# Altium schematic sheet daq_testing.SchDoc
size A; SheetNumber: 1; SheetTotal: 1
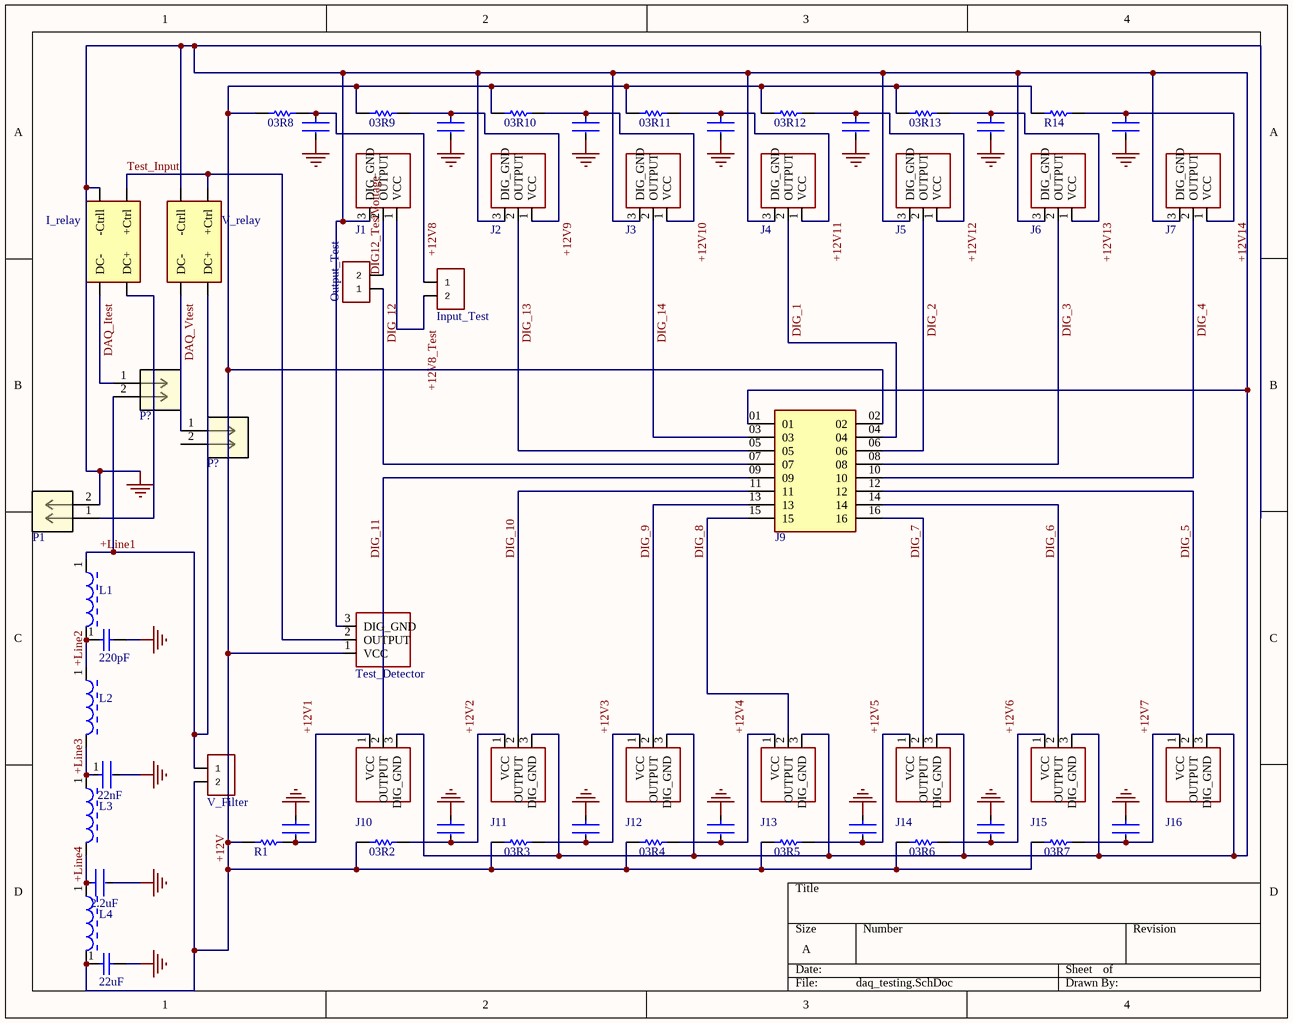
[diagram p0: daq_testing.SchDoc]

## Parts
(Parts that share a designator on the sheet are numbered #1, #2 ... from top to bottom, then left to right.)
2.2uF  C0805C223K5RACTU  [22nF]  (value not drawn)
03R2  ERJ-2BQJR30X  [03 Ohm]  (value not drawn)
03R3  ERJ-2BQJR30X  [03 Ohm]  (value not drawn)
03R4  ERJ-2BQJR30X  [03 Ohm]  (value not drawn)
03R5  ERJ-2BQJR30X  [03 Ohm]  (value not drawn)
03R6  ERJ-2BQJR30X  [03 Ohm]  (value not drawn)
03R7  ERJ-2BQJR30X  [03 Ohm]  (value not drawn)
03R8  ERJ-2BQJR30X  [03 Ohm]  (value not drawn)
03R9  ERJ-2BQJR30X  [03 Ohm]  (value not drawn)
03R10  ERJ-2BQJR30X  [03 Ohm]  (value not drawn)
03R11  ERJ-2BQJR30X  [03 Ohm]  (value not drawn)
03R12  ERJ-2BQJR30X  [03 Ohm]  (value not drawn)
03R13  ERJ-2BQJR30X  [03 Ohm]  (value not drawn)
22nF  GRM3195C1H223JA01  [22nF]  (value not drawn)
22uF  C0805C226M9PACTU  [22uF]  (value not drawn)
100nF1  C0805C104K5RACTU  [100nF]  (value not drawn)
100nF2  C0805C104K5RACTU  [100nF]  (value not drawn)
100nF3  C0805C104K5RACTU  [100nF]  (value not drawn)
100nF4  C0805C104K5RACTU  [100nF]  (value not drawn)
100nF5  C0805C104K5RACTU  [100nF]  (value not drawn)
100nF6  C0805C104K5RACTU  [100nF]  (value not drawn)
100nF7  C0805C104K5RACTU  [100nF]  (value not drawn)
100nF8  C0805C104K5RACTU  [100nF]  (value not drawn)
100nF9  C0805C104K5RACTU  [100nF]  (value not drawn)
100nF10  C0805C104K5RACTU  [100nF]  (value not drawn)
100nF11  C0805C104K5RACTU  [100nF]  (value not drawn)
100nF12  C0805C104K5RACTU  [100nF]  (value not drawn)
100nF13  C0805C104K5RACTU  [100nF]  (value not drawn)
100nF14  C0805C104K5RACTU  [100nF]  (value not drawn)
220pF  GRM1555C1H221JA01  [220pF]  (value not drawn)
I_relay  Solid state relay  [CPC1002N]  (value not drawn)
Input_Test  PRPC001DFAN-RC  [PRPC001DFAN-RC]  (value not drawn)
J1  IF-D95T  [IF-D95]  (value not drawn)
J2  IF-D95T  [IF-D95]  (value not drawn)
J3  IF-D95T  [IF-D95]  (value not drawn)
J4  IF-D95T  [IF-D95]  (value not drawn)
J5  IF-D95T  [IF-D95]  (value not drawn)
J6  IF-D95T  [IF-D95]  (value not drawn)
J7  IF-D95T  [IF-D95]  (value not drawn)
J9  HW-08-11-F-D-511-SM  [16 pin receiver]  (value not drawn)
J10  IF-D95T  [IF-D95]  (value not drawn)
J11  IF-D95T  [IF-D95]  (value not drawn)
J12  IF-D95T  [IF-D95]  (value not drawn)
J13  IF-D95T  [IF-D95]  (value not drawn)
J14  IF-D95T  [IF-D95]  (value not drawn)
J15  IF-D95T  [IF-D95]  (value not drawn)
J16  IF-D95T  [IF-D95]  (value not drawn)
L1  SRN3015-1R0Y  [1uH]  (value not drawn)
L2  SRN3015-1R0Y  [1uH]  (value not drawn)
L3  SRN3015-1R0Y  [1uH]  (value not drawn)
L4  SRN3015-1R0Y  [1uH]  (value not drawn)
Output_Test  PRPC001DFAN-RC  [PRPC001DFAN-RC]  (value not drawn)
P1  1054311102  [CONN_1054311102_MOL]  (value not drawn)
P?#1  1054311102  [CONN_1054311102_MOL]  (value not drawn)
P?#2  1054311102  [CONN_1054311102_MOL]  (value not drawn)
R1  ERJ-2BQJR30X  [03 Ohm]  (value not drawn)
R14  ERJ-2BQJR30X  [03 Ohm]  (value not drawn)
Test_Detector  IF-D95T  [IF-D95]  (value not drawn)
V_Filter  PRPC001DFAN-RC  [PRPC001DFAN-RC]  (value not drawn)
V_relay  Solid state relay  [CPC1002N]  (value not drawn)

## Nets
GND: 2.2uF.2 22nF.2 22uF.2 100nF1.1 100nF2.1 100nF3.1 100nF4.1 100nF5.1 100nF6.1 100nF7.1 100nF8.2 100nF9.2 100nF10.2 100nF11.2 100nF12.2 100nF13.2 100nF14.2 220pF.2 I_relay.2(-Ctrll) J1.3(DIG_GND) J2.3(DIG_GND) J3.3(DIG_GND) J4.3(DIG_GND) J5.3(DIG_GND) J6.3(DIG_GND) J7.3(DIG_GND) J9.01 J10.3(DIG_GND) J11.3(DIG_GND) J12.3(DIG_GND) J13.3(DIG_GND) J14.3(DIG_GND) J15.3(DIG_GND) J16.3(DIG_GND) P1.2 Test_Detector.3(DIG_GND) V_relay.2(-Ctrll)
+12V: 03R2.1 03R3.1 03R4.1 03R5.1 03R6.1 03R7.1 03R8.1 03R9.1 03R10.1 03R11.1 03R12.1 03R13.1 22uF.1 J9.02 L4.2 R1.1 R14.1 Test_Detector.1(VCC) V_Filter.2
+12V1: 100nF1.2 J10.1(VCC) R1.2
+12V2: 03R2.2 100nF2.2 J11.1(VCC)
+12V3: 03R3.2 100nF3.2 J12.1(VCC)
+12V4: 03R4.2 100nF4.2 J13.1(VCC)
+12V5: 03R5.2 100nF5.2 J14.1(VCC)
+12V6: 03R6.2 100nF6.2 J15.1(VCC)
+12V7: 03R7.2 100nF7.2 J16.1(VCC)
+12V8: 03R8.2 100nF8.1 Input_Test.1
+12V8_Test: Input_Test.2 J1.1(VCC)
+12V9: 03R9.2 100nF9.1 J2.1(VCC)
+12V10: 03R10.2 100nF10.1 J3.1(VCC)
+12V11: 03R11.2 100nF11.1 J4.1(VCC)
+12V12: 03R12.2 100nF12.1 J5.1(VCC)
+12V13: 03R13.2 100nF13.1 J6.1(VCC)
+12V14: 100nF14.1 J7.1(VCC) R14.2
+Line1: L1.1 P?#1.2 V_Filter.1 V_relay.4(DC+)
+Line2: 220pF.1 L1.2 L2.1
+Line3: 22nF.1 L2.2 L3.1
+Line4: 2.2uF.1 L3.2 L4.1
DAQ_Itest: I_relay.3(DC-) P?#1.1
DAQ_Vtest: P?#2.1 V_relay.3(DC-)
DIG12_TestVoltage: J1.2(OUTPUT) Output_Test.2
DIG_1: J4.2(OUTPUT) J9.04
DIG_2: J5.2(OUTPUT) J9.06
DIG_3: J6.2(OUTPUT) J9.08
DIG_4: J7.2(OUTPUT) J9.10
DIG_5: J9.12 J16.2(OUTPUT)
DIG_6: J9.14 J15.2(OUTPUT)
DIG_7: J9.16 J14.2(OUTPUT)
DIG_8: J9.15 J13.2(OUTPUT)
DIG_9: J9.13 J12.2(OUTPUT)
DIG_10: J9.11 J11.2(OUTPUT)
DIG_11: J9.09 J10.2(OUTPUT)
DIG_12: J9.07 Output_Test.1
DIG_13: J2.2(OUTPUT) J9.05
DIG_14: J3.2(OUTPUT) J9.03
Test_Input: I_relay.1(+Ctrl) Test_Detector.2(OUTPUT) V_relay.1(+Ctrl)
NetI_relay_4: I_relay.4(DC+) P1.1

Not connected (* = marked no-connect by the designer): P?#2 2

## Library data of the parts
2.2uF = C0805C223K5RACTU: KEMET - C0805C223K5RACTU - CAP, MLCC, X7R, 22NF, 50V, 0805; Dielectric Material: Ceramic; Tolerance: 10%; Supplier 1: Digi-Key; Supplier Part Number 1: 399-1163-1-ND; Manufacturer: KEMET; Manufacturer Part Number: C0805C223K5RACTU; RoHS: Yes; Category: Ceramic Capacitors; Stock 1: 179680; Pricing 1: 1=0.10000, 10=0.05200, 50=0.02840, 100=0.02320, 500=0.01656, 1000=0.01301 (USD); Mount: Surface Mount,PCB; Case/Package: 0805; Case Code (Imperial): 0805; Case Code (Metric): 2012; Weight: 0.000194oz; Min Operating Temperature: -55°C; Max Operating Temperature: 125°C; Packaging: Tape and Reel; Capacitance: 22nF; Dielectric: X7R; Voltage Rating: 50V; Voltage Rating (DC): 50V; Voltage: 50V; Series: C0805C; Termination: SMD/SMT; Construction: Flat; Length: 2mm; Width: 1.2mm; Height: 0.78mm; Depth: 1.25mm; Radiation Hardening: No; RoHS Compliant: Yes; REACH SVHC: No SVHC; ComponentLink1URL: https://datasheet.ciiva.com/18193/getdatasheetpartid-385695-18193669.pdf?src-supplier=Verical; ComponentLink1Description: https://datasheet.ciiva.com/18193/getdatasheetpartid-385695-18193669.pdf?src-supplier=Verical
03R2-03R13 R1 R14 = ERJ-2BQJR30X: RES 0.3 OHM 5% 1/6W 0402; Manufacturer: Panasonic; Max Power Dissipation: 167mW; Temperature Coefficient: 250ppm/°C; Resistance: 300mR; Supplier 1: Digi-Key; Supplier Part Number 1: P17347CT-ND; Manufacturer Part Number: ERJ-2BQJR30X; RoHS: Yes; Category: Chip SMD Resistors; Stock 1: 18282; Pricing 1: 1=0.21000, 10=0.17600, 25=0.12800, 50=0.09280, 100=0.06880, 250=0.05280, 500=0.04160, 1000=0.02880, 5000=0.02400 (USD); Case/Package: 0402; Case Code (Imperial): 0402; Case Code (Metric): 1005; Min Operating Temperature: -55°C; Max Operating Temperature: 125°C; Features: Automotive AEC-Q200; Tolerance: 5%; Packaging: Tape and Reel; Resistor Type: Thick Film; Number of Terminations: 2; Length: 0.039inch; Width: 0.02inch; Height: 0.016inch; ComponentLink1URL: http://www.mouser.com/ds/2/315/AOA0000C295-1109214.pdf?src-supplier=Mouser; ComponentLink1Description: http://www.mouser.com/ds/2/315/AOA0000C295-1109214.pdf?src-supplier=Mouser; ComponentLink2URL: https://industrial.panasonic.com/cdbs/www-data/pdf/RDN0000/AOA0000C313.pdf?src-supplier=Digi-Key; ComponentLink2Description: https://industrial.panasonic.com/cdbs/www-data/pdf/RDN0000/AOA0000C313.pdf?src-supplier=Digi-Key
22nF = GRM3195C1H223JA01: MURATA - GRM3195C1H223JA01 - CAP; Manufacturer: KEMET; Manufacturer Part Number: C0805C223K5RACTU; Dielectric Material: Ceramic; Tolerance: 10%; Dielectric: X7R; Voltage Rating: 50V; RoHS: Yes; Category: Ceramic Capacitors; Stock 1: 179680; Pricing 1: 1=0.10000, 10=0.05200, 50=0.02840, 100=0.02320, 500=0.01656, 1000=0.01301 (USD); Mount: Surface Mount,PCB; Case/Package: 0805; Case Code (Imperial): 0805; Case Code (Metric): 2012; Weight: 0.000194oz; Min Operating Temperature: -55°C; Max Operating Temperature: 125°C; Packaging: Tape and Reel; Capacitance: 22nF; Voltage Rating (DC): 50V; Voltage: 50V; Series: C0805C; Termination: SMD/SMT; Construction: Flat; Length: 2mm; Width: 1.2mm; Height: 0.78mm; Depth: 1.25mm; Radiation Hardening: No; RoHS Compliant: Yes; REACH SVHC: No SVHC; ComponentLink1URL: https://datasheet.ciiva.com/18193/getdatasheetpartid-385695-18193669.pdf?src-supplier=Verical; ComponentLink1Description: https://datasheet.ciiva.com/18193/getdatasheetpartid-385695-18193669.pdf?src-supplier=Verical; Supplier 1: Digi-Key; Supplier Part Number 1: 490-1761-1-ND
22uF = C0805C226M9PACTU: KEMET         C0805C226M9PACTU            CERAMIC CAPACITOR, 22UF, 6.3V, X5R, 20%, 0805, FULL REEL; Dissipation Factor: 5%; Supplier 1: Digi-Key; Supplier Part Number 1: 399-4696-1-ND; Manufacturer: KEMET; Manufacturer Part Number: C0805C226M9PACTU; RoHS: Yes; Category: Ceramic Capacitors; Stock 1: 337605; Pricing 1: 1=0.21000, 10=0.14400, 50=0.08660, 100=0.07320, 500=0.05004, 1000=0.04428 (USD); Mount: Surface Mount,PCB; Case/Package: 0805; Number of Pins: 2; Case Code (Imperial): 0805; Case Code (Metric): 2012; Dielectric Material: Ceramic; Min Operating Temperature: -55°C; Max Operating Temperature: 85°C; Capacitance: 22uF; Tolerance: 20%; Package Quantity: 2500; Voltage Rating: 6.3V; Voltage Rating (DC): 6.3V; Packaging: Tape and Reel; Termination: SMD/SMT; Voltage: 6.3V; Construction: Flat; Dielectric: X5R; Length: 2mm; Width: 1.2mm; Height: 1.25mm; Depth: 1.25mm; Radiation Hardening: No; Lead Free: Lead Free; REACH SVHC: No SVHC; RoHS Compliant: Yes; ComponentLink1URL: https://datasheet.ciiva.com/7842/40889-7842585.pdf?src-supplier=Element14; ComponentLink1Description: https://datasheet.ciiva.com/7842/40889-7842585.pdf?src-supplier=Element14; ComponentLink2URL: https://datasheet.ciiva.com/18193/getdatasheetpartid-344134-18193702.pdf?src-supplier=Verical; ComponentLink2Description: https://datasheet.ciiva.com/18193/getdatasheetpartid-344134-18193702.pdf?src-supplier=Verical; ComponentLink3URL: https://datasheet.ciiva.com/22748/1918694-22748303.pdf?src-supplier=Element14; ComponentLink3Description: https://datasheet.ciiva.com/22748/1918694-22748303.pdf?src-supplier=Element14
100nF1-100nF14 = C0805C104K5RACTU: Cap Ceramic 0.1uF 50V X7R 10% SMD 2.0 x 1.2 mm 125 C Paper T/R; Manufacturer: KEMET; Voltage: 500V; Supplier 1: Digi-Key; Supplier Part Number 1: 399-1170-1-ND; Manufacturer Part Number: C0805C104K5RACTU; RoHS: Yes; Category: Ceramic Capacitors; Stock 1: 2447786; Pricing 1: 1=0.15000, 10=0.11000, 50=0.06220, 100=0.05150, 500=0.03612, 1000=0.02991 (USD); Mount: Surface Mount,PCB; Case/Package: 0805; Number of Pins: 2; Case Code (Imperial): 0805; Case Code (Metric): 2012; Contact Plating: Tin,Matte; Dielectric Material: Ceramic; Min Operating Temperature: -55°C; Max Operating Temperature: 125°C; Capacitance: 100nF; Voltage Rating: 50V; Tolerance: 10%; Packaging: Tape and Reel; Dielectric: X7R; Package Quantity: 4000; Voltage Rating (DC): 50V; Series: C0805C; Termination: SMD/SMT; Construction: Flat; Length: 2mm; Width: 1.2mm; Height: 0.9mm; Thickness: 0.035inch; Depth: 1.25mm; Lead Pitch: 0.75mm; Radiation Hardening: No; RoHS Compliant: Yes; REACH SVHC: No SVHC; ComponentLink1URL: https://datasheet.ciiva.com/28682/1851736-28682232.pdf?src-supplier=Element14; ComponentLink1Description: https://datasheet.ciiva.com/28682/1851736-28682232.pdf?src-supplier=Element14; ComponentLink2URL: https://datasheet.ciiva.com/14589/70095383-14589048.pdf?src-supplier=Allied+Electronics; ComponentLink2Description: https://datasheet.ciiva.com/14589/70095383-14589048.pdf?src-supplier=Allied+Electronics; ComponentLink3URL: https://datasheet.ciiva.com/32431/slceramic-chip-condensers-e-32431755.pdf?src-supplier=Distrelec; ComponentLink3Description: https://datasheet.ciiva.com/32431/slceramic-chip-condensers-e-32431755.pdf?src-supplier=Distrelec; ComponentLink4URL: https://datasheet.ciiva.com/18410/70095383-18410815.pdf?src-supplier=Allied+Electronics; ComponentLink4Description: https://datasheet.ciiva.com/18410/70095383-18410815.pdf?src-supplier=Allied+Electronics
220pF = GRM1555C1H221JA01: MURATA - 220 pF; Manufacturer: KEMET; Manufacturer Part Number: C0402C221K5RACTU; Dielectric Material: Ceramic; Voltage Rating: 50V; Tolerance: 10%; Dielectric: X7R; Dissipation Factor: 2.5%; RoHS: Yes; Category: Ceramic Capacitors; Stock 1: 199654; Pricing 1: 1=0.10000, 10=0.03600, 50=0.01980, 100=0.01620, 500=0.01156, 1000=0.00908, 2500=0.00825, 5000=0.00759 (USD); Mount: Surface Mount,PCB; Case/Package: 0402; Number of Pins: 2; Case Code (Imperial): 0402; Case Code (Metric): 1005; Contact Plating: Tin,Matte; Weight: 2.3E-05oz; Min Operating Temperature: -55°C; Max Operating Temperature: 125°C; Capacitance: 220pF; Packaging: Tape and Reel; Voltage Rating (DC): 50V; Package Quantity: 1; Termination: SMD/SMT; Voltage: 50V; Series: C; Construction: Flat; Length: 1mm; Width: 0.5mm; Height: 0.5mm; Thickness: 0.022inch; Depth: 0.5mm; Lead Pitch: 0.3mm; Radiation Hardening: No; RoHS Compliant: Yes; REACH SVHC: No SVHC; ComponentLink1URL: https://datasheet.ciiva.com/7747/1807957-7747493.pdf?src-supplier=Element14; ComponentLink1Description: https://datasheet.ciiva.com/7747/1807957-7747493.pdf?src-supplier=Element14; ComponentLink2URL: https://datasheet.ciiva.com/5969/kem-c1002-x7r-smd-5969768.pdf?src-supplier=Farnell; ComponentLink2Description: https://datasheet.ciiva.com/5969/kem-c1002-x7r-smd-5969768.pdf?src-supplier=Farnell; ComponentLink3URL: https://datasheet.ciiva.com/14609/70095383-14609163.pdf?src-supplier=Allied+Electronics; ComponentLink3Description: https://datasheet.ciiva.com/14609/70095383-14609163.pdf?src-supplier=Allied+Electronics; ComponentLink4URL: https://datasheet.ciiva.com/28645/1851736-28645422.pdf?src-supplier=Element14; ComponentLink4Description: https://datasheet.ciiva.com/28645/1851736-28645422.pdf?src-supplier=Element14; Supplier 1: Avnet; Supplier Part Number 1: GRM1555C1H221JA01D
I_relay V_relay = CPC1002N
Input_Test Output_Test V_Filter = PRPC001DFAN-RC: Conn Header Vert 2POS; Manufacturer: Sullins; Number of Positions: 2; Connector Type: Male Pin; Row Spacing: 0.1inch; Supplier 1: Digi-Key; Supplier Part Number 1: S2211EC-01-ND; Manufacturer Part Number: PRPC001DFAN-RC; RoHS: Yes; Category: Connectors; Stock 1: 5964; Pricing 1: 1=0.09000, 10=0.08300, 25=0.06160, 50=0.05280, 100=0.05110, 250=0.04404, 500=0.04226 (USD); Mount: Through Hole; Color: Black; Contact Plating: Gold; Packaging: Bulk; Number of Rows: 2; Package Quantity: 1; Termination: Solder; Contact Mating Length: 0.318inch; ComponentLink1URL: https://datasheet.ciiva.com/741/xrxczzzdxxn-rc-11636-b-741404.pdf?src-supplier=Digi-Key; ComponentLink1Description: https://datasheet.ciiva.com/741/xrxczzzdxxn-rc-11636-b-741404.pdf?src-supplier=Digi-Key
J1-J7 J10-J16 Test_Detector = IF-D95T: DETECTOR PHOTOLOGIC TTL/CMOS; Manufacturer: Industrial Fiber Optics; Data Rate: 125Kbps; Operating Supply Current: 6mA; Rise Time: 70ns; Supplier 1: Digi-Key; Supplier Part Number 1: FB123-ND; Manufacturer Part Number: IF-D95T; RoHS: No; Category: Fiber Optic Cables; Package Quantity: 50; Lead Free: Contains Lead; ComponentLink1URL: https://datasheet.ciiva.com/2106/ifd95-2106550.pdf?src-supplier=Digi-Key; ComponentLink1Description: https://datasheet.ciiva.com/2106/ifd95-2106550.pdf?src-supplier=Digi-Key
J9 = HW-08-11-F-D-507-SM: System: Connector
L1-L4 = SRN3015-1R0Y: INDUCTOR, POWER, 1UH, SEMI SHIELDED; Manufacturer: Bourns; Core Material: Ferrite; Material: Steel; Self Resonant Frequency: 145MHz; Tolerance: 30%; Current Rating: 2.35A; DC Resistance (DCR): 48mR; Test Frequency: 1MHz; Supplier 1: Digi-Key; Supplier Part Number 1: SRN3015-1R0YCT-ND; Manufacturer Part Number: SRN3015-1R0Y; RoHS: Yes; Category: Fixed Inductors; Stock 1: 8610; Pricing 1: 1=0.46000, 10=0.40400, 25=0.37520, 50=0.31760, 100=0.28880, 250=0.27144, 500=0.24256, 1000=0.19635 (USD); Case/Package: 1212; Number of Pins: 2; Weight: 0.001235oz; Contact Plating: Tin; Min Operating Temperature: -40°C; Max Operating Temperature: 125°C; Shielding: Shielded; Package Quantity: 2000; Inductance: 1uH; Packaging: Tape and Reel; Max DC Current: 2.35A; Termination: SMD/SMT; Inductance Tolerance: 30%; Saturation Current: 2.35A; RMS Current (Irms): 2.35A; Series: SRN3015; Resistor Type: Wirewound; DC Current: 2.35A; Frequency: 145MHz; Sample Rate (Hz): 1MHz; Length: 3mm; Width: 3mm; Height: 1.5mm; Depth: 3.1mm; Height - Seated (Max): 0.059inch; REACH SVHC: No SVHC; Military Standard: Not; RoHS Compliant: Yes; ComponentLink1URL: https://datasheet.ciiva.com/11802/0900766b80fe1f40-11802588.pdf?src-supplier=RSComponents; ComponentLink1Description: https://datasheet.ciiva.com/11802/0900766b80fe1f40-11802588.pdf?src-supplier=RSComponents; ComponentLink2URL: https://datasheet.ciiva.com/16940/70230774-16940935.pdf?src-supplier=Allied+Electronics; ComponentLink2Description: https://datasheet.ciiva.com/16940/70230774-16940935.pdf?src-supplier=Allied+Electronics; ComponentLink3URL: https://datasheet.ciiva.com/1048/srn3015-1048824.pdf?src-supplier=Digi-Key; ComponentLink3Description: https://datasheet.ciiva.com/1048/srn3015-1048824.pdf?src-supplier=Digi-Key; ComponentLink4URL: https://datasheet.ciiva.com/28678/1481208-28678232.pdf?src-supplier=Element14; ComponentLink4Description: https://datasheet.ciiva.com/28678/1481208-28678232.pdf?src-supplier=Element14; ComponentLink5URL: https://datasheet.ciiva.com/30197/587srn3015-30197944.pdf?src-supplier=Onlinecomponents.com; ComponentLink5Description: https://datasheet.ciiva.com/30197/587srn3015-30197944.pdf?src-supplier=Onlinecomponents.com; ComponentLink6URL: https://datasheet.ciiva.com/1048/srn3015-1048825.pdf?src-supplier=Digi-Key; ComponentLink6Description: https://datasheet.ciiva.com/1048/srn3015-1048825.pdf?src-supplier=Digi-Key; ComponentLink7URL: https://datasheet.ciiva.com/1048/srn3015-1048826.pdf?src-supplier=Digi-Key; ComponentLink7Description: https://datasheet.ciiva.com/1048/srn3015-1048826.pdf?src-supplier=Digi-Key; ComponentLink8URL: https://datasheet.ciiva.com/17284/srn3015-17284732.pdf?src-supplier=Avnet+Europe; ComponentLink8Description: https://datasheet.ciiva.com/17284/srn3015-17284732.pdf?src-supplier=Avnet+Europe; ComponentLink9URL: https://datasheet.ciiva.com/8517/srn3015-8517694.pdf?src-supplier=Avnet; ComponentLink9Description: https://datasheet.ciiva.com/8517/srn3015-8517694.pdf?src-supplier=Avnet; ComponentLink10URL: https://datasheet.ciiva.com/5986/srn3015-5986175.pdf?src-supplier=Farnell; ComponentLink10Description: https://datasheet.ciiva.com/5986/srn3015-5986175.pdf?src-supplier=Farnell; ComponentLink11URL: https://datasheet.ciiva.com/7847/srn3015-7847903.pdf?src-supplier=Element14; ComponentLink11Description: https://datasheet.ciiva.com/7847/srn3015-7847903.pdf?src-supplier=Element14
P1 P?#1 P?#2 = 1054311102: Nano-Fit Vertical Header, Surface Mount, 2.50mm Pitch, Single Row, 2 Circuits, 0.76 u00B5m Tin (Sn) Plating, Black,...; Manufacturer: Molex; Supplier 1: Digi-Key; Supplier Part Number 1: WM26073CT-ND; Manufacturer Part Number: 1054311102; RoHS: No; Category: Connectors; Stock 1: 1192; Pricing 1: 1=2.05000, 10=1.85700, 100=1.59160 (USD)